# EAGLE design Robert Sullivan touch (EAGLE 8.2.1)
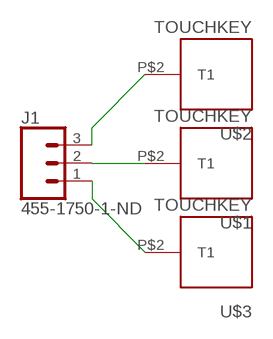
[diagram p0: schematic, sheet 1]

## Parts
J1  455-1750-1-ND  CONN_03  [1X03]
U$1  TOUCHKEY  [TOUCHPAD]
U$2  TOUCHKEY  [TOUCHPAD]
U$3  TOUCHKEY  [TOUCHPAD]

## Nets
N$1: J1.3 U$2.P$2(T1)
N$2: J1.1 U$3.P$2(T1)
N$3: J1.2 U$1.P$2(T1)

## Library data of the parts
J1 = SparkFun-Connectors:CONN_03: Multi connection point. Often used as Generic Header-pin footprint for 0.1 inch spaced/style header connections On any of the 0.1 inch spaced packages, you can populate with these: Break Away Headers - Straight <https://www.sparkfun.com/products/116> (PRT-00116) Break Away Male Headers - Right Angle <https://www.sparkfun.com/products/553> (PRT-00553) Female Headers <https://www.sparkfun.com/products/115> (PRT-00115) Break Away Headers - Machine Pin <https://www.sparkfun.com/products/117> (PRT-00117) Break Away Female Headers - Swiss Machine Pin <https://www.sparkfun.com/products/743> (PRT-00743) Stackable Header - 3 Pin (Female, 0.1") <https://www.sparkfun.com/products/13875> (PRT-13875) For SCREWTERMINALS and SPRING TERMINALS visit here: Screw Terimnals on SparkFun.com <https://www.sparkfun.com/search/results?term=Screw+Terminals> (5mm/3.5mm/2.54mm spacing) This device is also useful as a general connection point to wire up your design to another part of your project. Our various solder wires solder well into these plated through hole pads. Hook-Up Wire - Assortment (Stranded, 22 AWG) <https://www.sparkfun.com/products/11375> (PRT-11375) Hook-Up Wire - Assortment (Solid Core, 22 AWG) <https://www.sparkfun.com/products/11367> (PRT-11367) View the entire wire category on our website here <https://www.sparkfun.com/categories/141> Special notes: Molex polarized connector foot print use with SKU : PRT-08232 with associated crimp pins and housings.; PROD_ID: XXX-00000
U$1-U$3 = MVTHS:TOUCHKEY

## Net classes
0 default: width 0.508 mm, drill 0.305 mm, clearance 0.305 mm

## Board
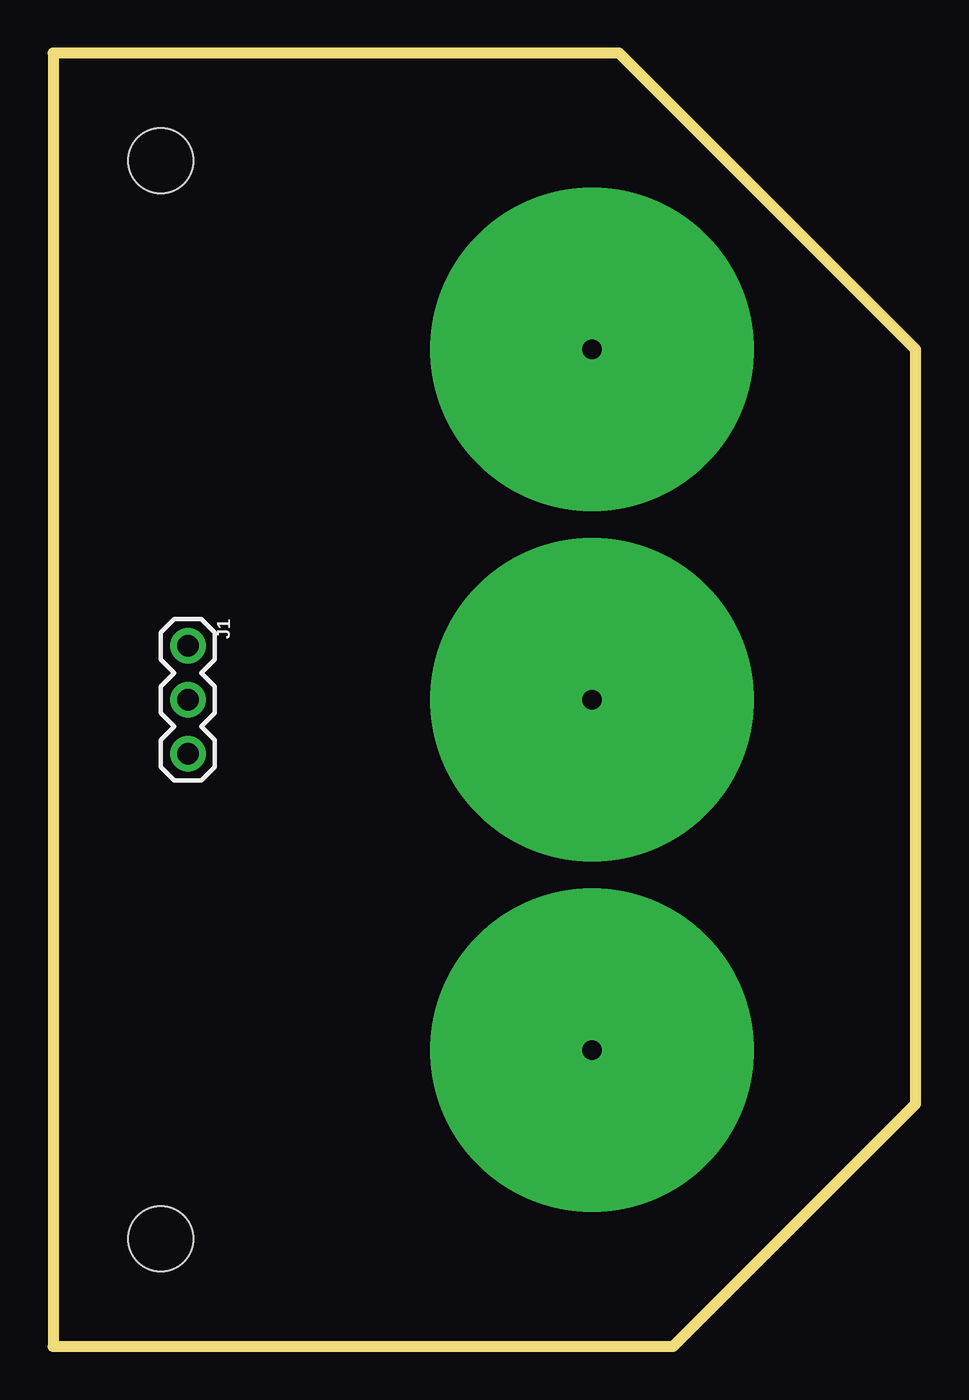
[diagram p1: board, top side]
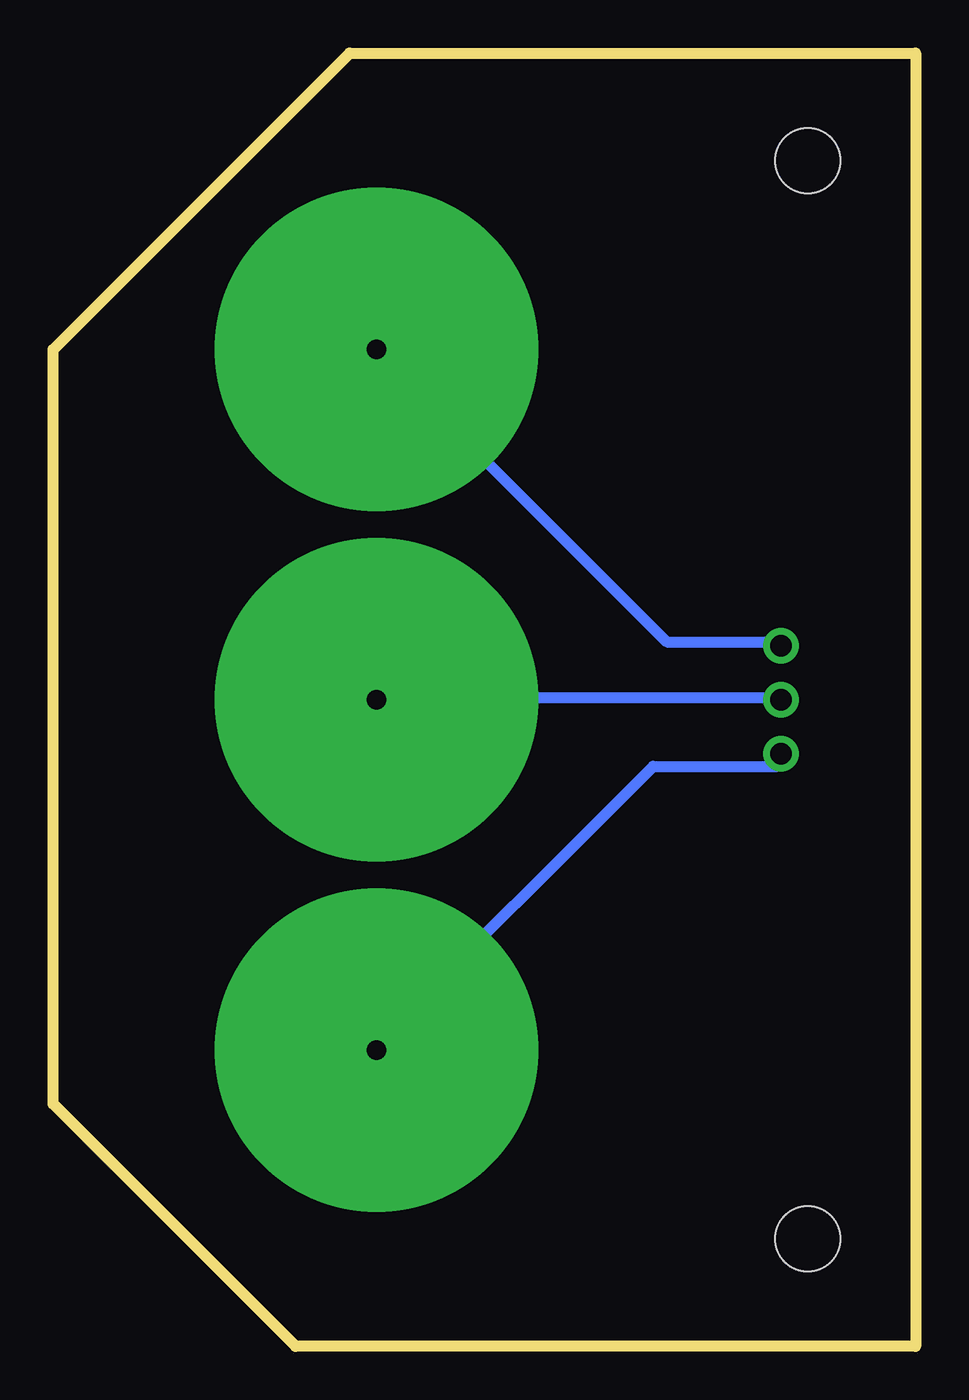
[diagram p2: board, bottom side, seen from below]

Size 40.64 x 60.96 mm. Coordinates in mm from the lower left corner, seen from the top.
Outline: 0,0 29.21,0 40.64,11.43 40.64,46.99 26.67,60.96 0,60.96 0,0
Copper layers (1*16): Top 0.035mm / dielectric 1.5mm / Bottom 0.035mm
Design rules "OthermillDRC_1_32_v2": minimum track width 8mil, minimum drill 0.8mm, track to track 0.794003125mm, track to pad 0.794003125mm, pad to pad 0.794003125mm, via to via 0.794003125mm, smd to smd 0mil, copper to edge 0mil, drill to drill 1mil, minimum pad ring 10mil, minimum via ring 10mil, stop-mask expansion 1mil, vias tented up to drill 30mil, thermal gap 10mil
Holes 3.05 mm at 5.08,55.88 5.08,5.08

### Footprints (pad centres in the part's own frame; a part is rotated, then mirrored left to right if it is on the bottom)
1X03 = drill 1.016 pad 1.676: 1 0,0; 2 2.54,0; 3 5.08,0
TOUCHPAD = drill 0.914 pad 15.24: P$2 0,0

### Placement (x,y rotation side)
J1  6.35,33.02 270 top
U$1  25.4,30.48 0 top
U$2  25.4,13.97 0 top
U$3  25.4,46.99 0 top

### Tracks (layer width: path | path; a pad name or v marks a point on that pad's centre or on a via)
N$1
  Bottom 0.508: J1.3 6.51,27.34 12.37,27.34 25.39,14.32 U$2.P$2
N$2
  Bottom 0.508: J1.1 6.51,33.2 11.72,33.2 25.39,46.87 U$3.P$2
N$3
  Bottom 0.508: J1.2 6.51,30.6 25.39,30.6 U$1.P$2